# EAGLE design cv_led (EAGLE 8.5.2)
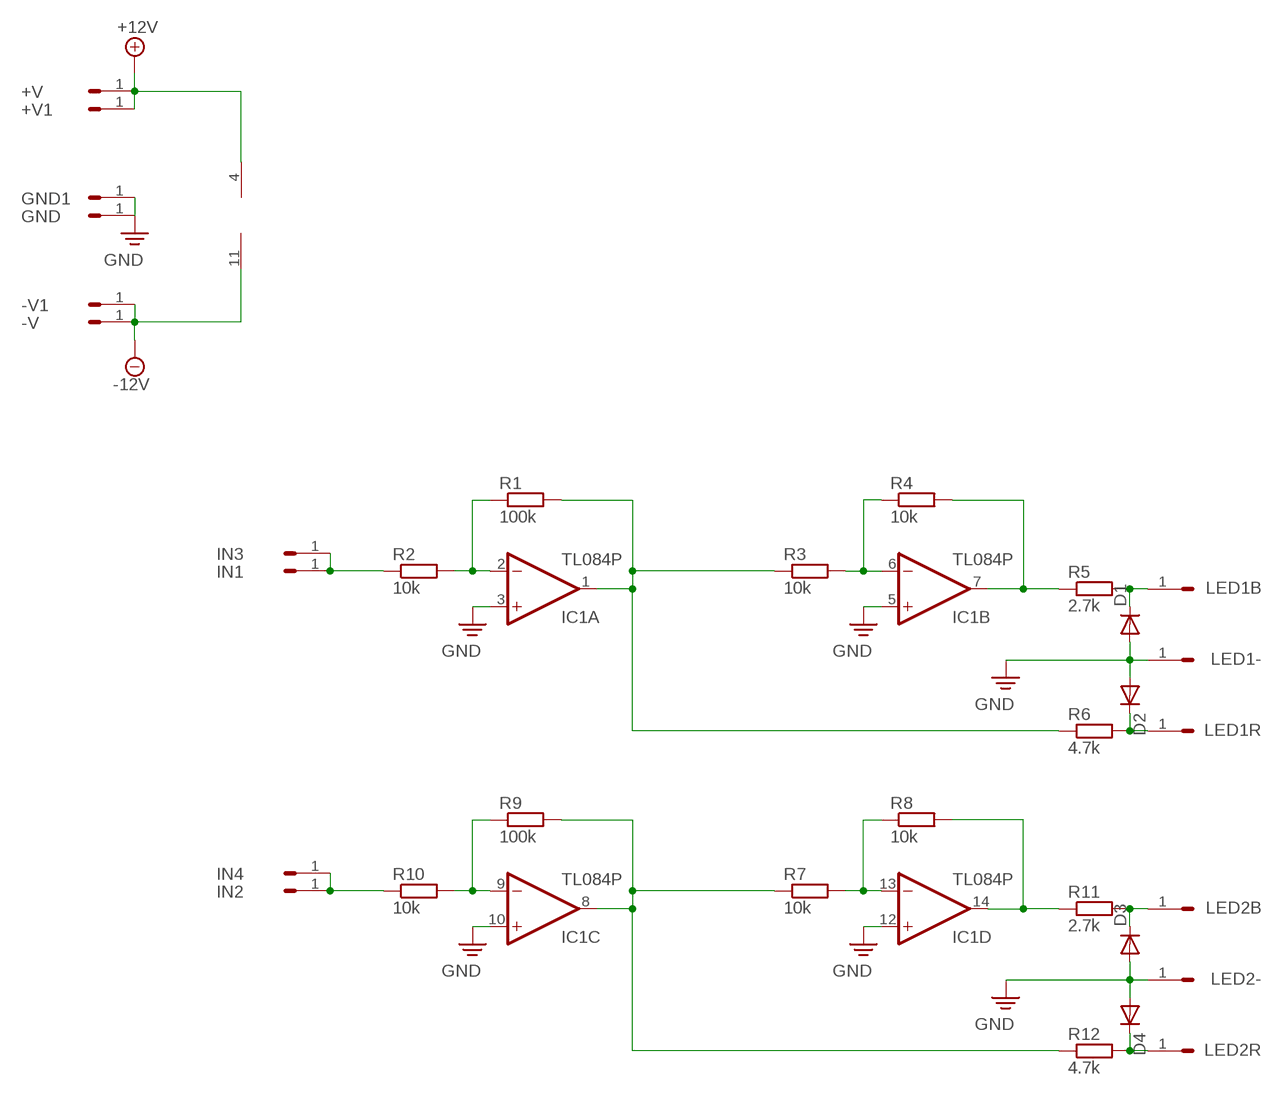
[diagram p0: schematic, sheet 1]

## Parts
+V  HEADER/MALE/01  [HEADER/MALE/01]
+V1  HEADER/MALE/01  [HEADER/MALE/01]
-V  HEADER/MALE/01  [HEADER/MALE/01]
-V1  HEADER/MALE/01  [HEADER/MALE/01]
D1  1N4148DO35-7  [DO35-7]
D2  1N4148DO35-7  [DO35-7]
D3  1N4148DO35-7  [DO35-7]
D4  1N4148DO35-7  [DO35-7]
GND  HEADER/MALE/01  [HEADER/MALE/01]
GND1  HEADER/MALE/01  [HEADER/MALE/01]
IC1  TL084P  [DIL14]
IN1  HEADER/MALE/01  [HEADER/MALE/01]
IN2  HEADER/MALE/01  [HEADER/MALE/01]
IN3  HEADER/MALE/01  [HEADER/MALE/01]
IN4  HEADER/MALE/01  [HEADER/MALE/01]
LED1-  HEADER/MALE/01  [HEADER/MALE/01]
LED1B  HEADER/MALE/01  [HEADER/MALE/01]
LED1R  HEADER/MALE/01  [HEADER/MALE/01]
LED2-  HEADER/MALE/01  [HEADER/MALE/01]
LED2B  HEADER/MALE/01  [HEADER/MALE/01]
LED2R  HEADER/MALE/01  [HEADER/MALE/01]
R1  100k  RESISTORRESISTOR/UPRIGHT/7.5  [RESISTOR/7.5]
R2  10k  RESISTORRESISTOR/UPRIGHT/7.5  [RESISTOR/7.5]
R3  10k  RESISTORRESISTOR/UPRIGHT/7.5  [RESISTOR/7.5]
R4  10k  RESISTORRESISTOR/UPRIGHT/7.5  [RESISTOR/7.5]
R5  2.7k  RESISTORRESISTOR/UPRIGHT/7.5  [RESISTOR/7.5]
R6  4.7k  RESISTORRESISTOR/UPRIGHT/7.5  [RESISTOR/7.5]
R7  10k  RESISTORRESISTOR/UPRIGHT/7.5  [RESISTOR/7.5]
R8  10k  RESISTORRESISTOR/UPRIGHT/7.5  [RESISTOR/7.5]
R9  100k  RESISTORRESISTOR/UPRIGHT/7.5  [RESISTOR/7.5]
R10  10k  RESISTORRESISTOR/UPRIGHT/7.5  [RESISTOR/7.5]
R11  2.7k  RESISTORRESISTOR/UPRIGHT/7.5  [RESISTOR/7.5]
R12  4.7k  RESISTORRESISTOR/UPRIGHT/7.5  [RESISTOR/7.5]

## Nets
+12V: +V1.1 +V.1 IC1.4(P:V+)
-12V: -V1.1 -V.1 IC1.11(P:V-)
GND: D1.A D2.A D3.A D4.A GND1.1 GND.1 IC1.3(A:+IN) IC1.5(B:+IN) IC1.10(C:+IN) IC1.12(D:+IN) LED1-.1 LED2-.1
N$1: IC1.6(B:-IN) R3.2 R4.1
N$2: IC1.2(A:-IN) R1.1 R2.2
N$3: IC1.1(A:OUT) R1.2 R3.1 R6.1
N$4: IN1.1 IN3.1 R2.1
N$5: IC1.7(B:OUT) R4.2 R5.1
N$6: D1.C LED1B.1 R5.2
N$7: D2.C LED1R.1 R6.2
N$8: IC1.13(D:-IN) R7.2 R8.1
N$9: IC1.9(C:-IN) R9.1 R10.2
N$10: IN2.1 IN4.1 R10.1
N$11: IC1.14(D:OUT) R8.2 R11.1
N$12: IC1.8(C:OUT) R7.1 R9.2 R12.1
N$14: D3.C LED2B.1 R11.2
N$15: D4.C LED2R.1 R12.2

## Library data of the parts
+V +V1 -V -V1 GND GND1 IN1-IN4 LED1- LED1B LED1R LED2- LED2B LED2R = connectors:HEADER/MALE/01; SPICEPREFIX: X
D1-D4 = transistors:1N4148: DIODE high speed (Philips)
IC1 = ic_analogue:TL084: OP AMP
R1-R12 = resistors:RESISTOR: RESISTOR, European symbol

## Board
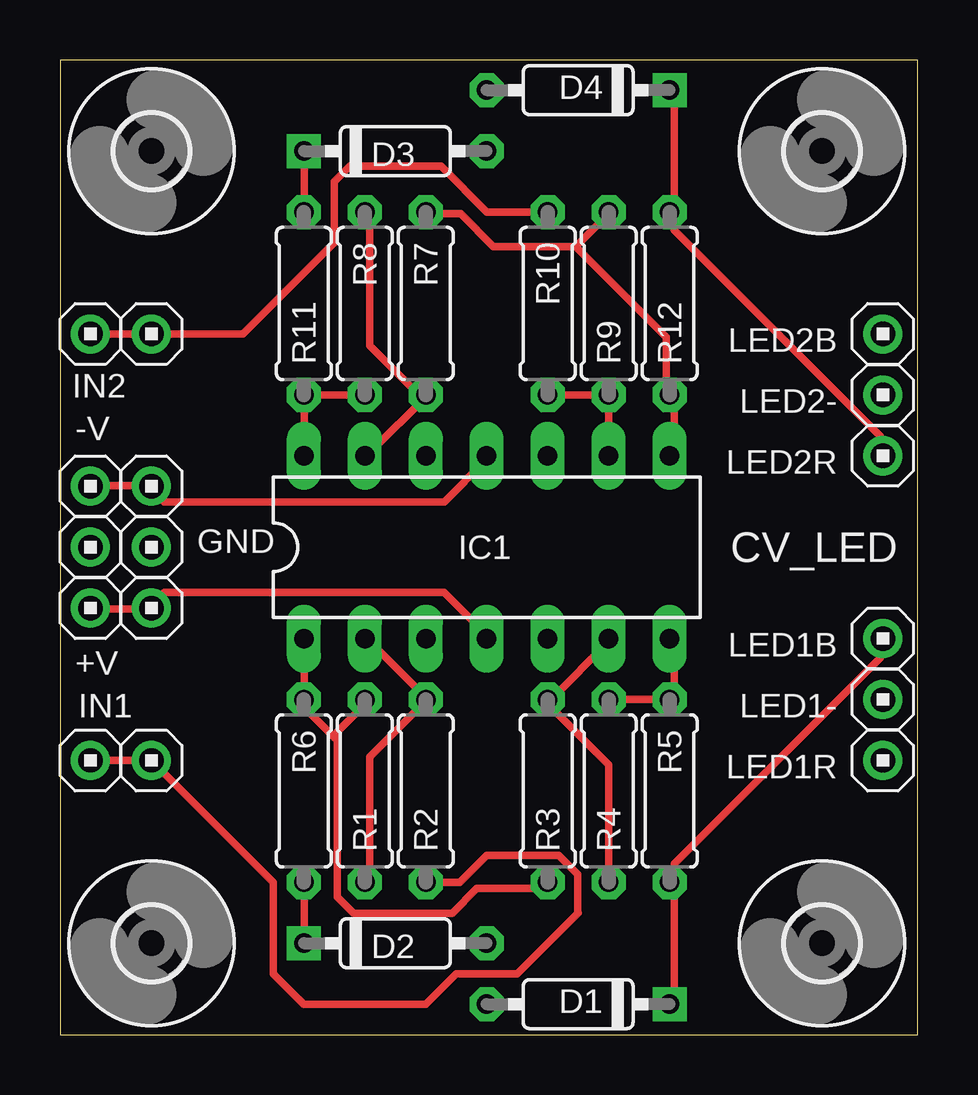
[diagram p1: board, top side]
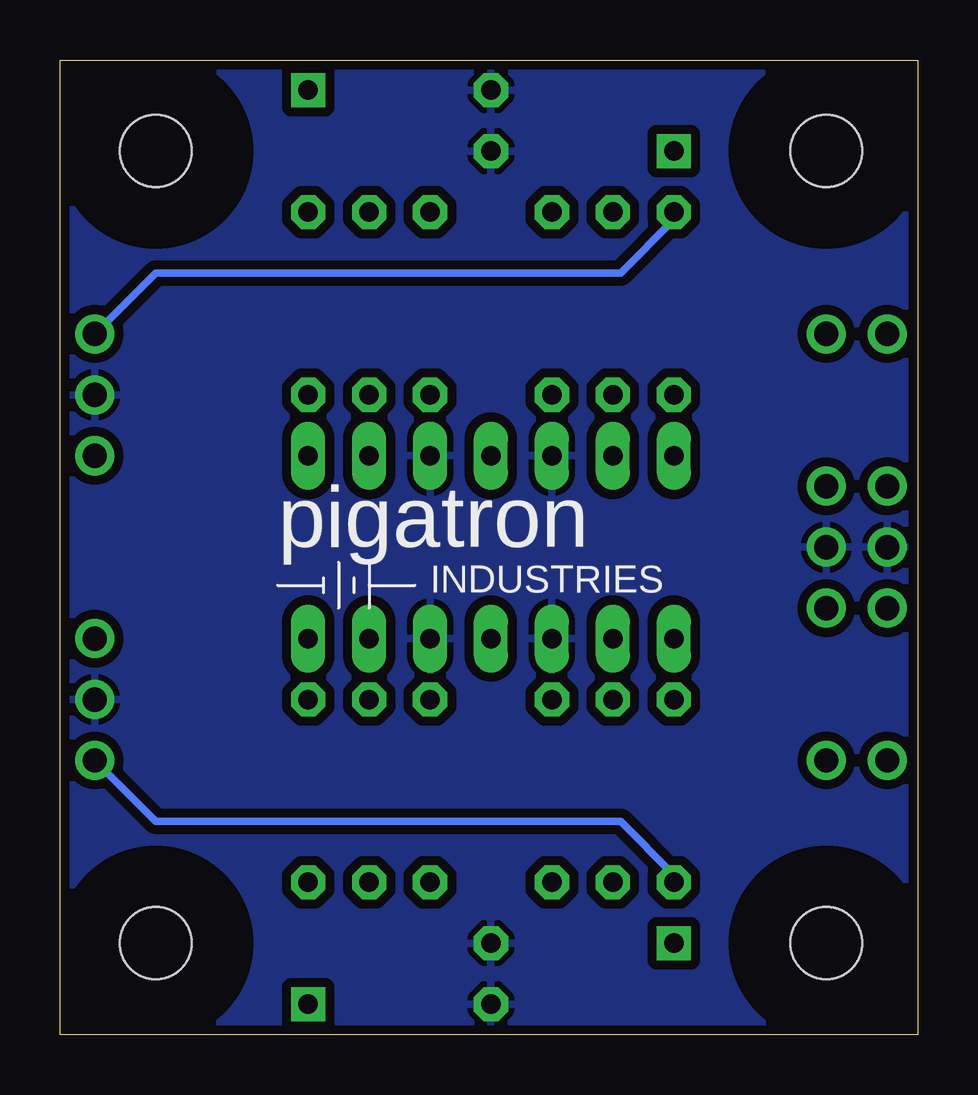
[diagram p2: board, bottom side, seen from below]

Size 35.74 x 40.63 mm. Coordinates in mm from the lower left corner, seen from the top.
Outline: 0,0 35.74,0 35.74,40.63 0,40.63 0,0
Copper layers (1*16): Top 0.0356mm / dielectric 1.5011mm / Bottom 0.0356mm
Design rules "pigatron": minimum track width 12mil, minimum drill 13mil, track to track 15mil, track to pad 10mil, pad to pad 10mil, via to via 10mil, smd to smd 6mil, copper to edge 15mil, drill to drill 10mil, minimum pad ring 12mil, minimum via ring 10mil, stop-mask expansion 4mil, vias tented up to drill 0mil, thermal gap 10mil

### Footprints (pad centres in the part's own frame; a part is rotated, then mirrored left to right if it is on the bottom)
HEADER/MALE/01 = drill 1.016: 1 0,0
DO35-7 = drill 0.813 octagon: A 3.81,0 | drill 0.813 square: C -3.81,0
DIL14 = drill 0.813 long: 1 -7.62,-3.81; 2 -5.08,-3.81; 3 -2.54,-3.81; 4 0,-3.81; 5 2.54,-3.81; 6 5.08,-3.81; 7 7.62,-3.81; 8 7.62,3.81; 9 5.08,3.81; 10 2.54,3.81; 11 0,3.81; 12 -2.54,3.81; 13 -5.08,3.81; 14 -7.62,3.81
RESISTOR/7.5 = drill 0.813 octagon: 1 -3.81,0; 2 3.81,0
STANDOFF/3.0 = hole 3: 0,0

### Placement (x,y rotation side)
+V  1.27,17.78 0 top
+V1  3.81,17.78 0 top
-V  1.27,22.86 0 top
-V1  3.81,22.86 0 top
D1  21.59,1.27 180 top
D2  13.97,3.81 0 top
D3  13.97,36.83 0 top
D4  21.59,39.37 180 top
GND  1.27,20.32 0 top
GND1  3.81,20.32 0 top
IC1  17.78,20.32 0 top
IN1  1.27,11.43 0 top
IN2  1.27,29.21 0 top
IN3  3.81,11.43 0 top
IN4  3.81,29.21 0 top
LED1-  34.29,13.97 180 top
LED1B  34.29,16.51 180 top
LED1R  34.29,11.43 180 top
LED2-  34.29,26.67 180 top
LED2B  34.29,29.21 180 top
LED2R  34.29,24.13 180 top
R1  12.7,10.16 90 top
R2  15.24,10.16 90 top
R3  20.32,10.16 90 top
R4  22.86,10.16 90 top
R5  25.4,10.16 270 top
R6  10.16,10.16 270 top
R7  15.24,30.48 270 top
R8  12.7,30.48 270 top
R9  22.86,30.48 90 top
R10  20.32,30.48 270 top
R11  10.16,30.48 90 top
R12  25.4,30.48 90 top
U$1  [STANDOFF/3.0]  3.81,3.81 0 top
U$2  [STANDOFF/3.0]  3.81,36.83 0 top
U$3  [PIGATRON-LOGO]  17.78,20.32 0 bottom
U$4  [STANDOFF/3.0]  31.75,3.81 0 top
U$5  [STANDOFF/3.0]  31.75,36.83 0 top

### Tracks (layer width: path | path; a pad name or v marks a point on that pad's centre or on a via)
+12V
  Top 0.305: IC1.4 17.72,16.73 16,18.44 4.34,18.44 4,18.1 +V1.1 3.66,17.75 1.6,17.75 +V.1
-12V
  Top 0.305: IC1.11 17.72,23.93 16,22.21 4.34,22.21 4,22.55 -V1.1 3.66,22.9 1.6,22.9 -V.1
GND
  pour Bottom: 0,40.64 0,0 35.56,0 35.56,40.64
N$1
  Top 0.305: IC1.6 22.86,16.38 20.46,13.98 R3.2 20.46,13.64 22.86,11.24 R4.1
N$2
  Top 0.305: R1.1 12.92,6.44 12.92,11.58 14.97,13.64 R2.2 15.32,13.98 12.92,16.38 IC1.2
N$3
  Top 0.305: 11.54,12.27 11.54,12.61 12.57,13.64 R1.2 | 11.54,12.27 11.54,5.75 12.23,5.07 16.34,5.07 17.37,6.1 20.12,6.1 R3.1 | 11.54,12.27 10.17,13.64 R6.1 10.17,13.98 10.17,16.38 IC1.1
N$4
  Top 0.305: IN1.1 IN3.1 8.89,6.35 8.89,2.54 10.16,1.27 15.24,1.27 16.51,2.54 19.05,2.54 21.59,5.08 21.56,5.1 21.56,6.69 20.78,7.47 17.77,7.47 16.66,6.35 R2.1
N$5
  Top 0.305: R4.2 22.86,13.98 25.26,13.98 R5.1 25.6,13.98 25.6,16.38 IC1.7
N$6
  Top 0.305: D1.C 25.6,1.29 25.6,6.1 R5.2 25.6,6.44 25.6,7.12 34.18,15.7 34.18,16.38 LED1B.1
N$7
  Top 0.305: D2.C 10.17,4.04 10.17,6.1 R6.2
  Bottom 0.305: LED1R.1 31.75,8.89 12.38,8.89 10.16,6.67 R6.2
N$8
  Top 0.305: IC1.13 12.92,24.27 15.32,26.67 R7.2 14.97,26.67 12.92,28.73 12.92,34.21 R8.1
N$9
  Top 0.305: IC1.9 R9.1 R10.2
N$10
  Top 0.305: IN2.1 IN4.1 7.62,29.21 11.43,33.02 11.43,35.56 12.07,36.2 15.88,36.2 17.78,34.29 R10.1
N$11
  Top 0.305: 10.17,26.67 10.17,24.27 IC1.14 | 10.17,26.67 R8.2 | 10.17,26.67 R11.1
N$12
  Top 0.305: IC1.8 25.6,24.27 25.6,26.67 R12.1 25.26,26.67 25.26,29.07 21.49,32.84 | 21.49,32.84 18.06,32.84 16.69,34.21 15.32,34.21 R7.1 | 21.49,32.84 22.86,34.21 R9.2
N$14
  Top 0.305: R11.2 10.17,34.56 10.17,36.61 D3.C
  Bottom 0.305: LED2B.1 31.75,31.75 12.38,31.75 10.16,33.97 R11.2
N$15
  Top 0.305: D4.C 25.6,39.36 25.6,34.56 R12.2 25.6,34.21 25.6,33.53 34.18,24.96 34.18,24.27 LED2R.1

### Text on the board
tNames: CV_LED